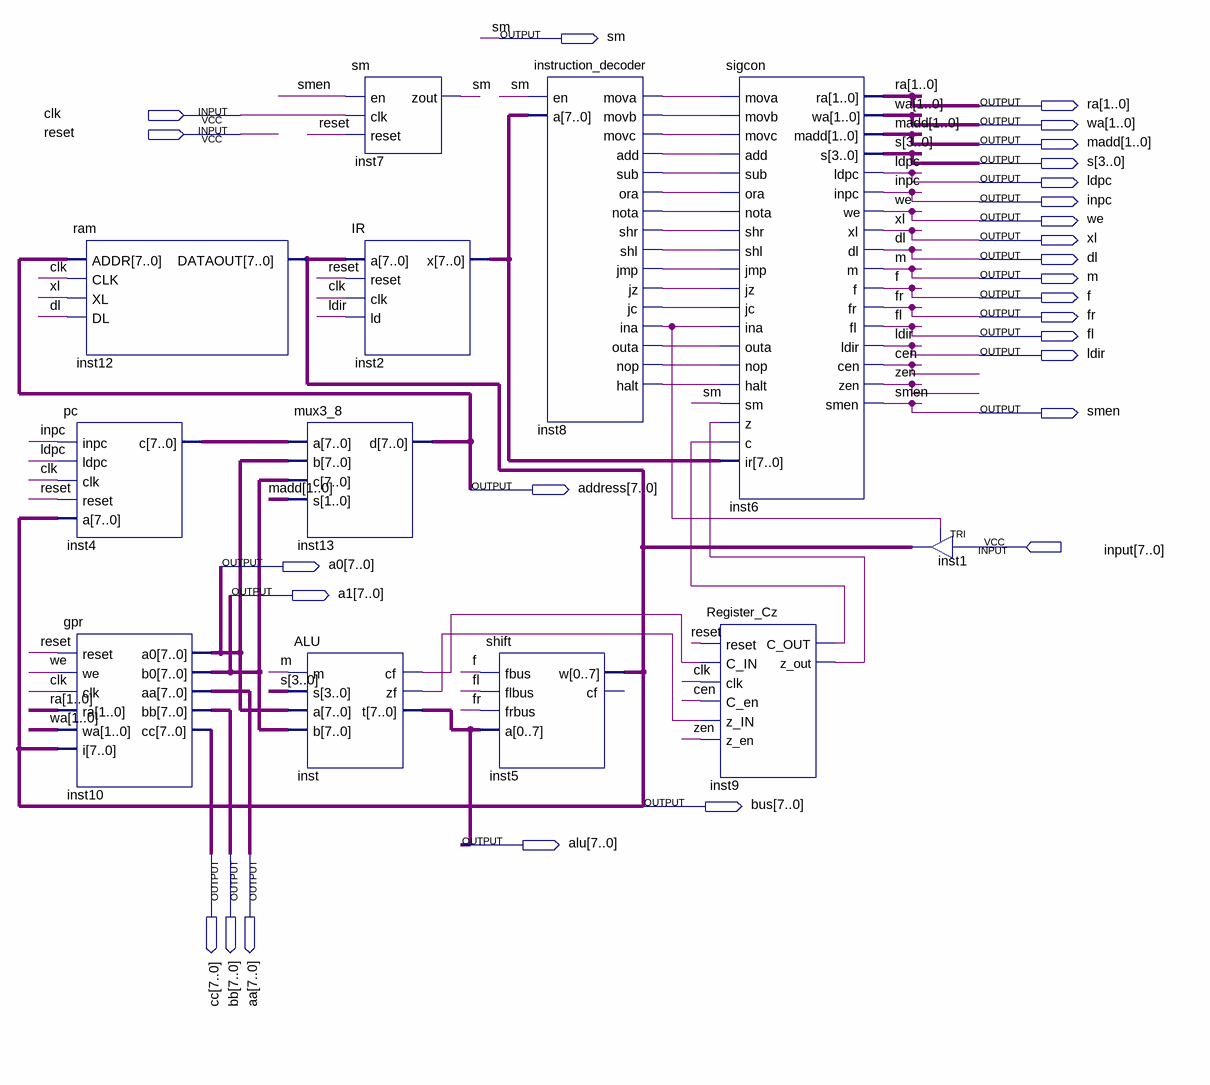
[diagram p0: schematic sheet]
// Quartus schematic cpu.bdf as structural Verilog: 12 symbols, 27 pins
module cpu (
  input  clk,
  input  reset,
  input  [7:0] \input ,
  output sm,
  output [1:0] ra,
  output [1:0] wa,
  output [1:0] madd,
  output [3:0] s,
  output ldpc,
  output inpc,
  output we,
  output xl,
  output dl,
  output m,
  output f,
  output fr,
  output fl,
  output ldir,
  output smen,
  output [7:0] address,
  output [7:0] a0,
  output [7:0] a1,
  output [7:0] bus,
  output [7:0] alu,
  output [7:0] cc,
  output [7:0] bb,
  output [7:0] aa
);

  wire cen, inst8_add, inst8_halt, inst8_ina, inst8_jc, inst8_jmp, inst8_jz, inst8_mova, inst8_movb,
       inst8_movc, inst8_nop, inst8_nota, inst8_ora, inst8_outa, inst8_shl, inst8_shr, inst8_sub,
       inst9_c_out, inst9_z_out, inst_cf, inst_zf, zen;
  wire [7:0] inst2_x, inst4_c;

  ram inst12 (.ADDR(address), .CLK(clk), .XL(xl), .DL(dl), .DATAOUT(bus));
  pc inst4 (.inpc(inpc), .ldpc(ldpc), .clk(clk), .reset(reset), .a(bus), .c(inst4_c));
  gpr inst10 (
    .reset(reset), .we(we), .clk(clk), .ra(ra), .wa(wa), .i(bus), .a0(a0), .b0(a1), .aa(aa), .bb(bb), .cc(cc));
  mux3_8 inst13 (.a(inst4_c), .b(a0), .c(a1), .s(madd), .d(address));
  ALU inst (.m(m), .s(s), .a(a0), .b(a1), .cf(inst_cf), .zf(inst_zf), .t(alu));
  sm inst7 (.en(smen), .clk(clk), .reset(reset), .zout(sm));
  IR inst2 (.a(bus), .reset(reset), .clk(clk), .ld(ldir), .x(inst2_x));
  instruction_decoder inst8 (
    .en(sm), .a(inst2_x), .mova(inst8_mova), .movb(inst8_movb), .movc(inst8_movc), .add(inst8_add),
    .sub(inst8_sub), .ora(inst8_ora), .nota(inst8_nota), .shr(inst8_shr), .shl(inst8_shl), .jmp(inst8_jmp),
    .jz(inst8_jz), .jc(inst8_jc), .ina(inst8_ina), .outa(inst8_outa), .nop(inst8_nop), .halt(inst8_halt));
  shift inst5 (.fbus(f), .flbus(fl), .frbus(fr), .a(alu), .w(bus));  // open: cf
  Register_Cz inst9 (
    .reset(reset), .C_IN(inst_cf), .clk(clk), .C_en(cen), .z_IN(inst_zf), .z_en(zen), .C_OUT(inst9_c_out),
    .z_out(inst9_z_out));
  sigcon inst6 (
    .mova(inst8_mova), .movb(inst8_movb), .movc(inst8_movc), .add(inst8_add), .sub(inst8_sub),
    .ora(inst8_ora), .nota(inst8_nota), .shr(inst8_shr), .shl(inst8_shl), .jmp(inst8_jmp), .jz(inst8_jz),
    .jc(inst8_jc), .ina(inst8_ina), .outa(inst8_outa), .nop(inst8_nop), .halt(inst8_halt), .sm(sm),
    .z(inst9_z_out), .c(inst9_c_out), .ir(inst2_x), .ra(ra), .wa(wa), .madd(madd), .s(s), .ldpc(ldpc),
    .inpc(inpc), .we(we), .xl(xl), .dl(dl), .m(m), .f(f), .fr(fr), .fl(fl), .ldir(ldir), .cen(cen),
    .zen(zen), .smen(smen));
  TRI inst1[7:0] (.IN(\input ), .OE(inst8_ina), .OUT(bus));
endmodule
